# EAGLE design 8x8matrix_tlc4 (EAGLE 7.1.0)
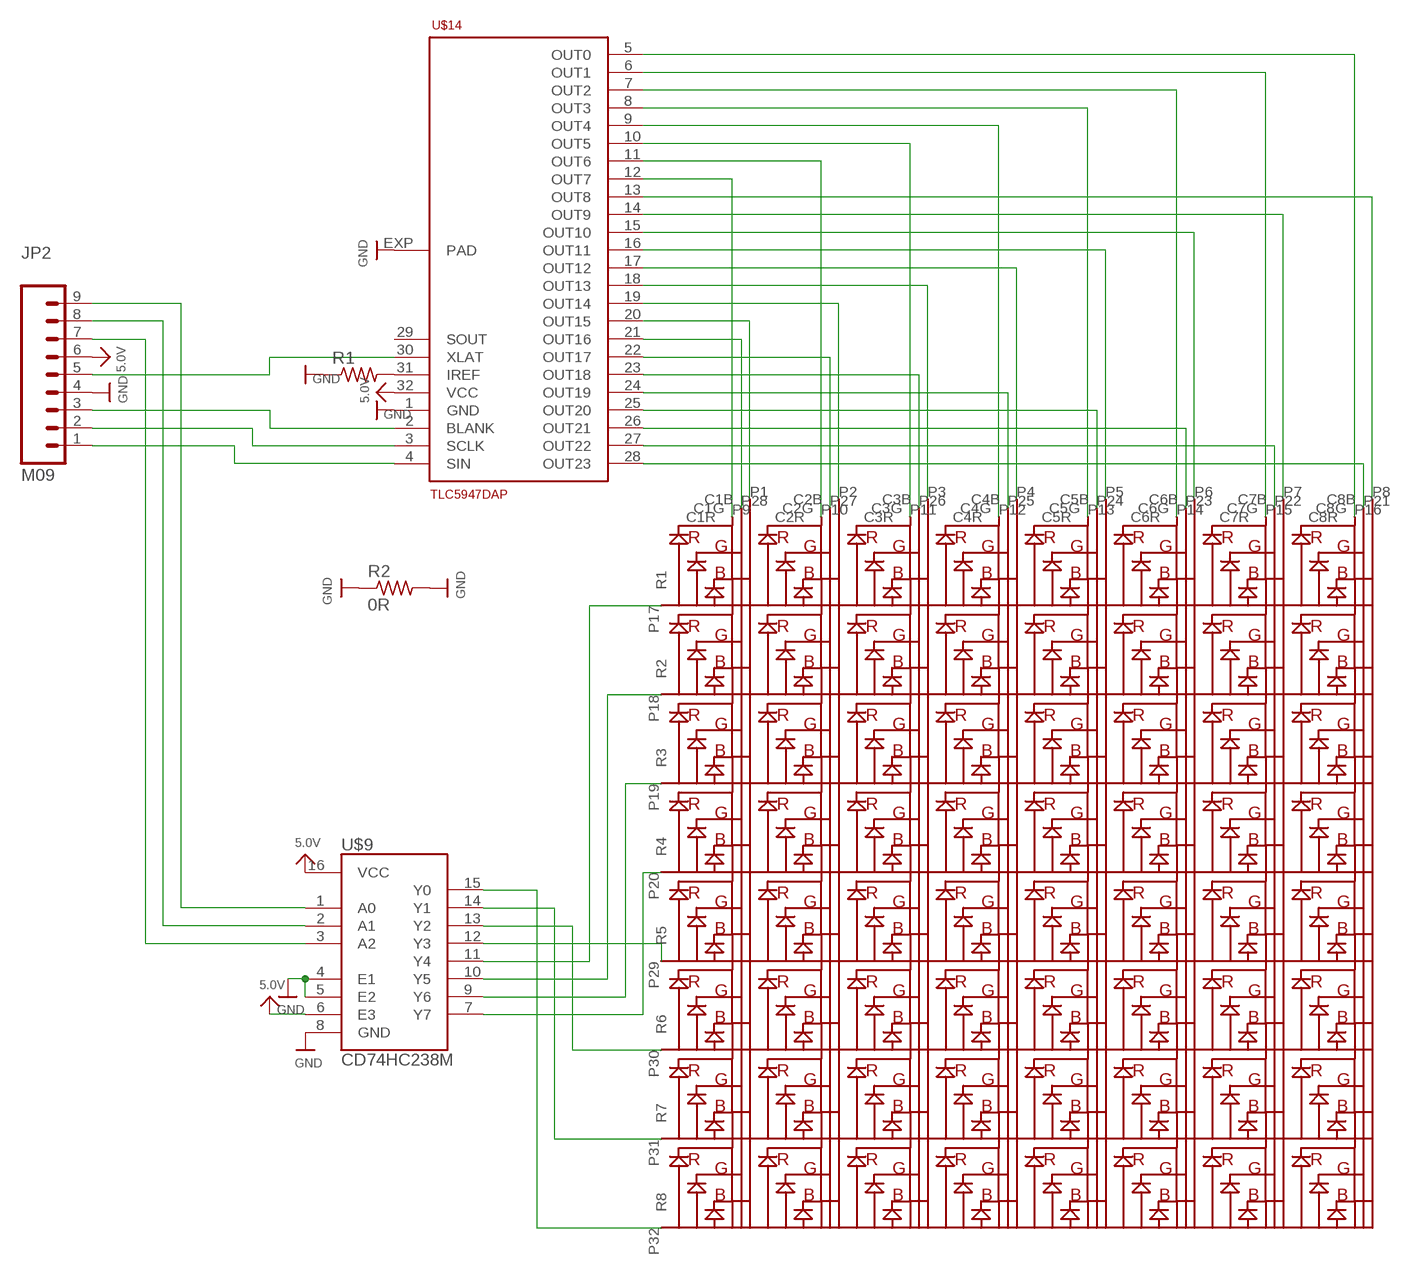
[diagram p0: schematic, sheet 1]

## Parts
JP2  M09  [1X09]
R1  R-US_R0805  [R0805]
R2  0R  R-US_M1206  [M1206]
U$1  GTM2088ARGB  [8X8MATRIX]
U$9  CD74HC238M  [SO-16]
U$14  TLC5947DAP  [HTSSOP32DAP]

## Nets
5.0V: JP2.6 U$9.6(E3) U$9.16(VCC) U$14.32(VCC)
BLANK: JP2.3 U$14.2(BLANK)
GND: JP2.4 R1.1 R2.1 R2.2 U$9.4(E1) U$9.5(E2) U$9.8(GND) U$14.1(GND) U$14.EXP(PAD)
N$1: U$1.P16(C8R) U$14.5(OUT0)
N$2: U$1.P15(C7R) U$14.6(OUT1)
N$3: U$1.P14(C6R) U$14.7(OUT2)
N$4: U$1.P13(C5R) U$14.8(OUT3)
N$5: U$1.P12(C4R) U$14.9(OUT4)
N$6: U$1.P11(C3R) U$14.10(OUT5)
N$7: U$1.P10(C2R) U$14.11(OUT6)
N$8: U$1.P9(C1R) U$14.12(OUT7)
N$9: U$1.P8(C8B) U$14.13(OUT8)
N$10: U$1.P7(C7B) U$14.14(OUT9)
N$11: U$1.P6(C6B) U$14.15(OUT10)
N$12: U$1.P5(C5B) U$14.16(OUT11)
N$13: U$1.P4(C4B) U$14.17(OUT12)
N$14: U$1.P3(C3B) U$14.18(OUT13)
N$15: U$1.P2(C2B) U$14.19(OUT14)
N$16: U$1.P1(C1B) U$14.20(OUT15)
N$17: U$1.P28(C1G) U$14.21(OUT16)
N$18: U$1.P27(C2G) U$14.22(OUT17)
N$19: U$1.P26(C3G) U$14.23(OUT18)
N$20: U$1.P25(C4G) U$14.24(OUT19)
N$21: U$1.P24(C5G) U$14.25(OUT20)
N$22: U$1.P23(C6G) U$14.26(OUT21)
N$23: U$1.P22(C7G) U$14.27(OUT22)
N$24: U$1.P21(C8G) U$14.28(OUT23)
N$25: JP2.5 U$14.30(XLAT)
N$26: U$1.P20(R4) U$9.7(Y7)
N$27: R1.2 U$14.31(IREF)
N$28: JP2.2 U$14.3(SCLK)
N$29: U$1.P19(R3) U$9.9(Y6)
N$30: U$1.P18(R2) U$9.10(Y5)
N$31: U$1.P17(R1) U$9.11(Y4)
N$32: U$1.P29(R5) U$9.12(Y3)
N$33: U$1.P30(R6) U$9.13(Y2)
N$34: U$1.P31(R7) U$9.14(Y1)
N$35: U$1.P32(R8) U$9.15(Y0)
N$36: JP2.9 U$9.1(A0)
N$37: JP2.8 U$9.2(A1)
N$38: JP2.7 U$9.3(A2)
SIN: JP2.1 U$14.4(SIN)
Unconnected: U$14.29(SOUT)

## Library data of the parts
JP2 = SparkFun-Connectors:M09: Header 9 Standard 9-pin 0.1" header. Use with straight break away headers (SKU : PRT-00116), right angle break away headers (PRT-00553), swiss pins (PRT-00743), machine pins (PRT-00117), and female headers (PRT-00115).
R1 R2 = resistor:R-US_: RESISTOR, American symbol
U$1 = mylib:GTM2088ARGB: a 8x8 RGB matrix
U$9 = mylib:CD74HC238: M74HC238 - CMOS 3 TO 8 LINE DECODER
U$14 = TLC5947:TLC5947

## Board
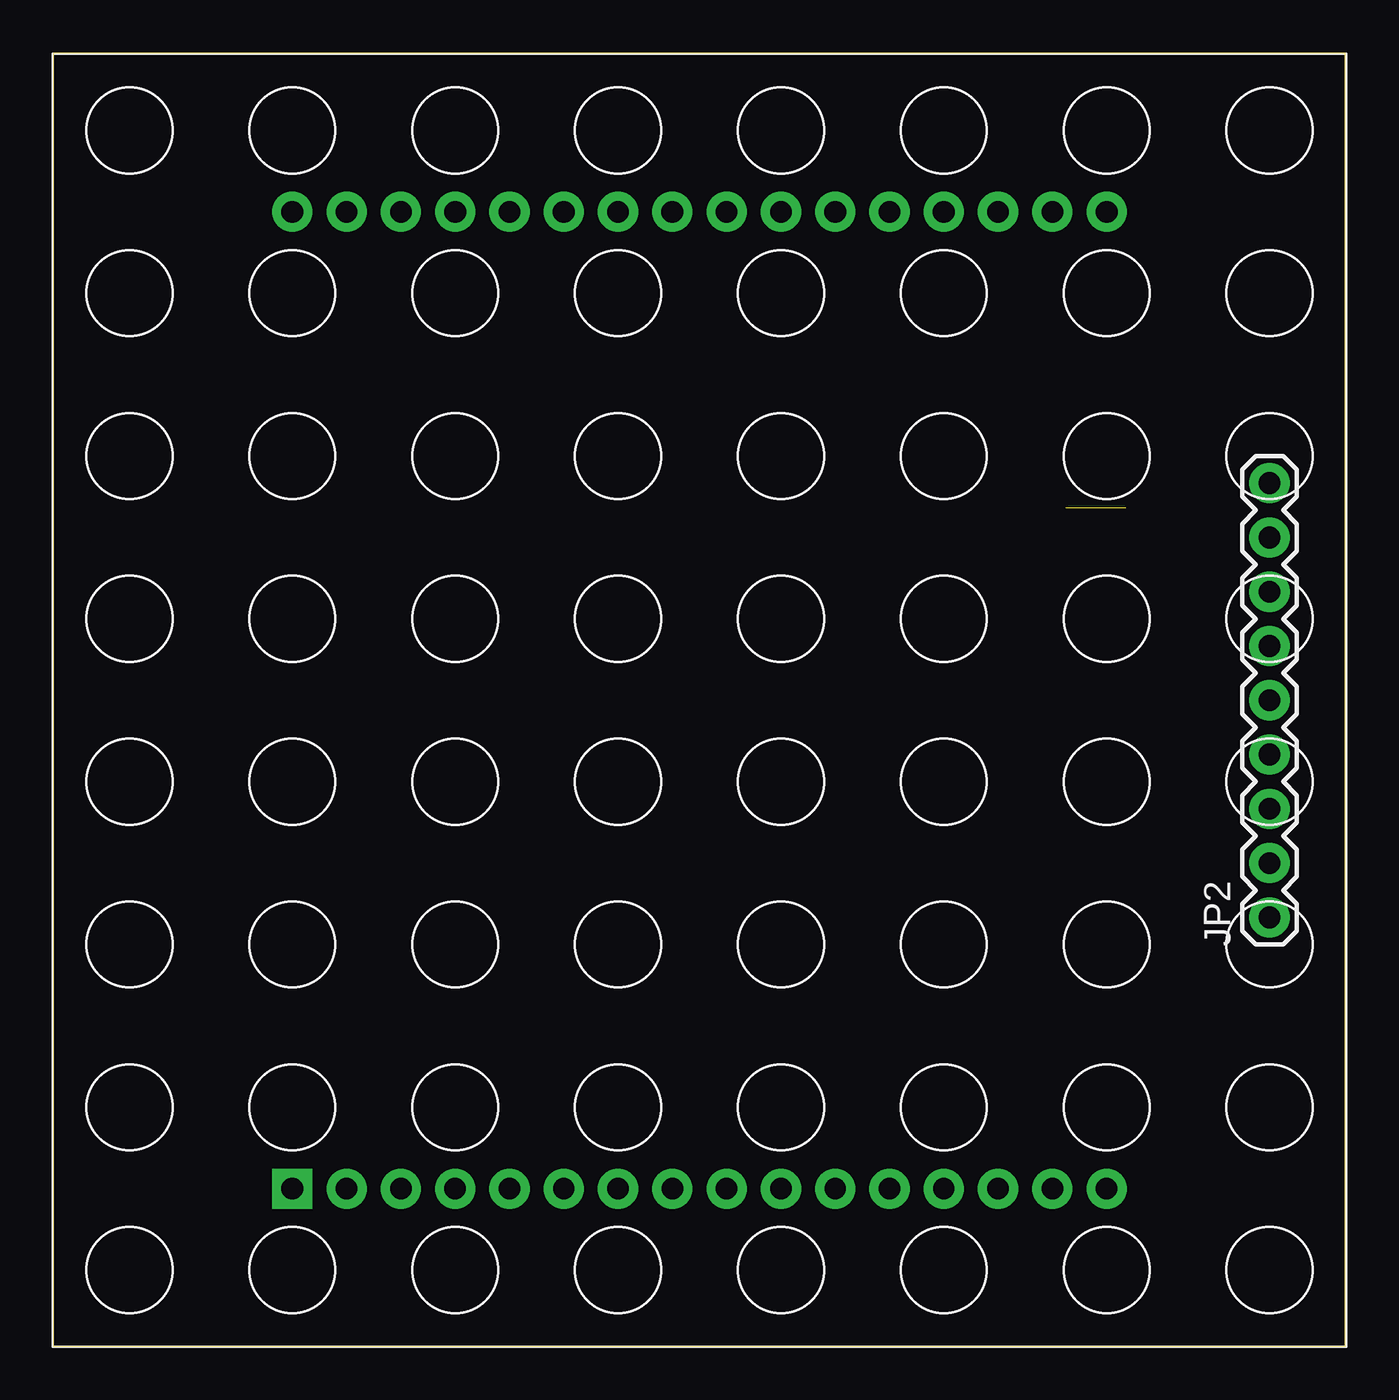
[diagram p1: board, top side]
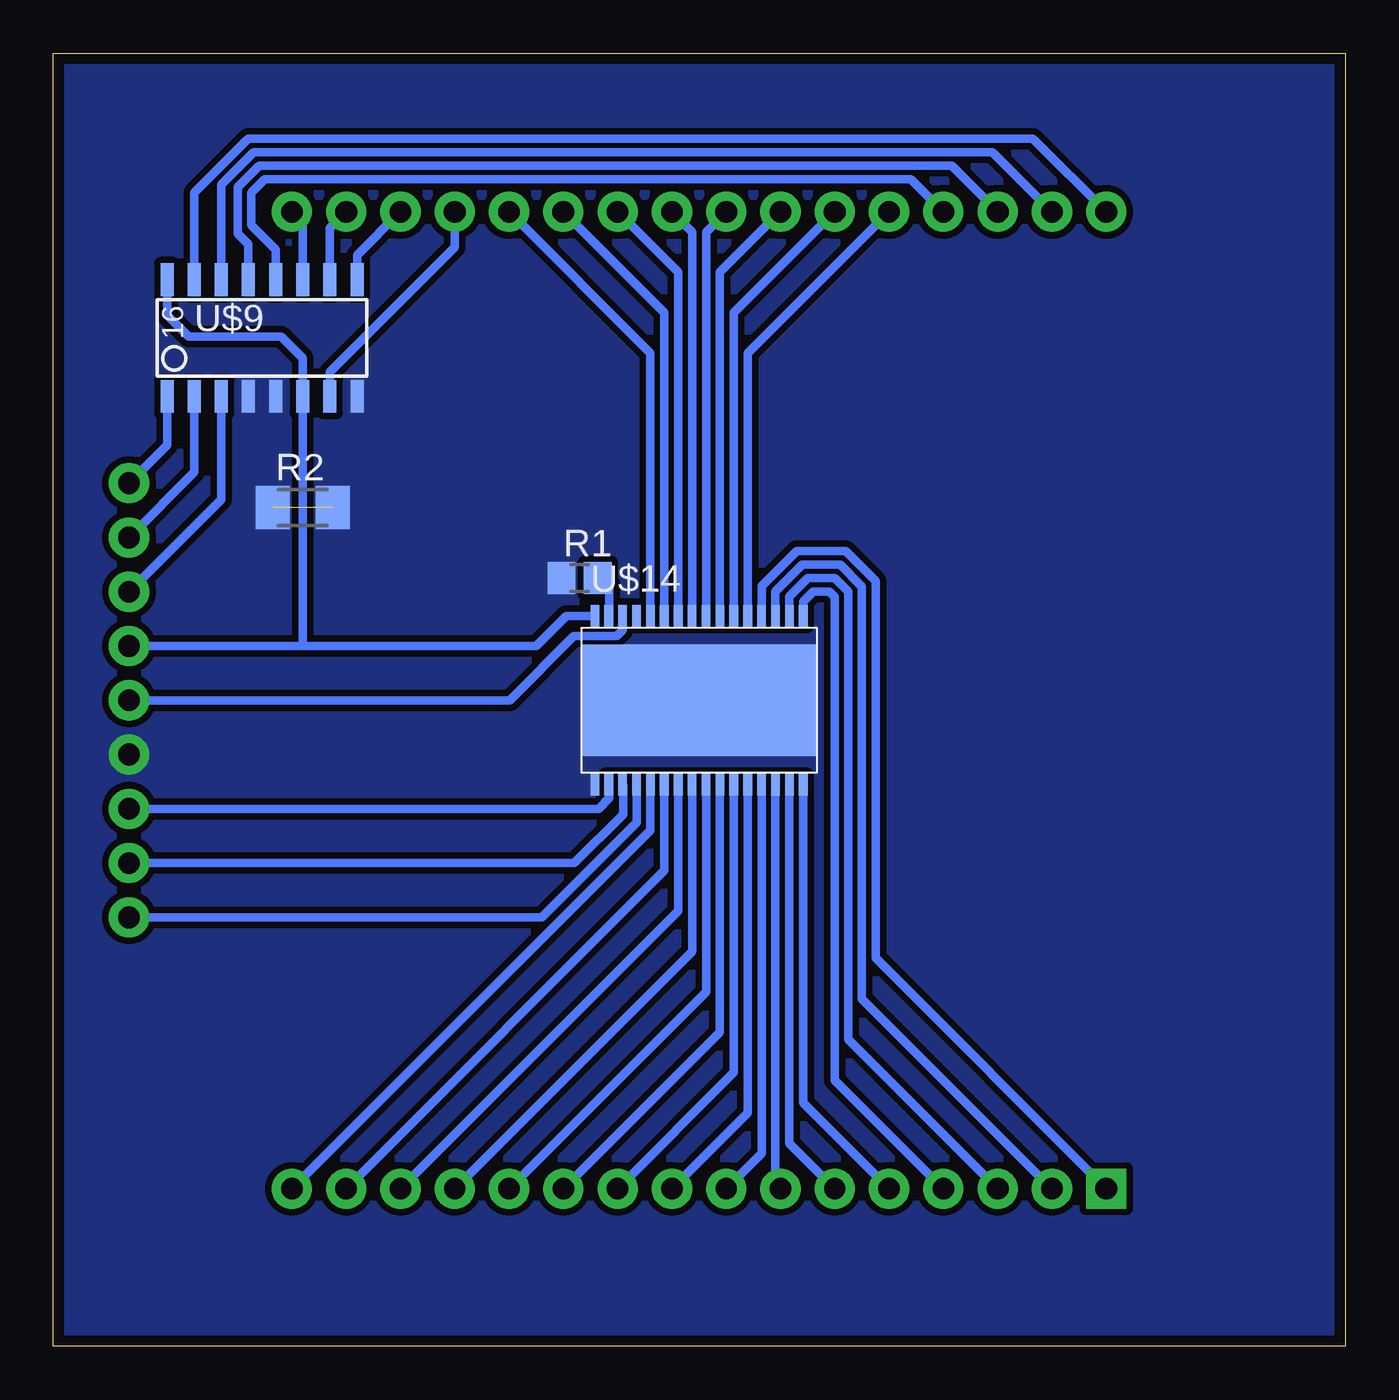
[diagram p2: board, bottom side, seen from below]

Size 60.43 x 60.5 mm. Coordinates in mm from the lower left corner, seen from the top.
Outline: 0,0 60.43,0 60.43,60.5 0,60.5 0,0
Copper layers (1*16): Top 0.035mm / dielectric 1.5mm / Bottom 0.035mm
Design rules "default *": minimum track width 10mil, minimum drill 24mil, track to track 8mil, track to pad 8mil, pad to pad 8mil, via to via 8mil, smd to smd 8mil, copper to edge 20mil, drill to drill 8mil, minimum pad ring 10mil, minimum via ring 8mil, stop-mask expansion 7mil, vias tented up to drill 0mil, thermal gap 10mil

### Footprints (pad centres in the part's own frame; a part is rotated, then mirrored left to right if it is on the bottom)
1X09 = drill 1.016 pad 1.88: 1 0,0; 2 2.54,0; 3 5.08,0; 4 7.62,0; 5 10.16,0; 6 12.7,0; 7 15.24,0; 8 17.78,0; 9 20.32,0
R0805 = smd 1.3 x 1.5: 1 -0.85,0; 2 0.85,0
M1206 = smd 1.6 x 2: 1 -1.4,0; 2 1.4,0
8X8MATRIX = drill 1.016 pad 1.88 square: P1 -19.05,-22.86 | drill 1.016 pad 1.88: P2 -16.51,-22.86; P3 -13.97,-22.86; P17 19.05,22.86; P18 16.51,22.86; P19 13.97,22.86; P20 11.43,22.86; P21 8.89,22.86; P22 6.35,22.86; P23 3.81,22.86; P24 1.27,22.86; P25 -1.27,22.86; P26 -3.81,22.86; P27 -6.35,22.86; P28 -8.89,22.86; P29 -11.43,22.86; P30 -13.97,22.86; P31 -16.51,22.86; P32 -19.05,22.86 | drill 1 pad 1.88: P4 -11.43,-22.86; P5 -8.89,-22.86; P6 -6.35,-22.86; P7 -3.81,-22.86; P8 -1.27,-22.86; P9 1.27,-22.86; P10 3.81,-22.86; P11 6.35,-22.86; P12 8.89,-22.86; P13 11.43,-22.86; P14 13.97,-22.86; P15 16.51,-22.86; P16 19.05,-22.86
SO-16 = smd 0.61 x 1.524: 1 -4.445,-2.794; 2 -3.175,-2.794; 3 -1.905,-2.794; 4 -0.635,-2.794; 5 0.635,-2.794; 6 1.905,-2.794; 7 3.175,-2.794; 8 4.445,-2.794; 9 4.445,2.667; 10 3.175,2.667; 11 1.905,2.667; 12 0.635,2.667; 13 -0.635,2.667; 14 -1.905,2.667; 15 -3.175,2.667; 16 -4.445,2.667
HTSSOP32DAP = smd 0.406 x 1: 1 -4.875,-3.95; 2 -4.225,-3.95; 3 -3.575,-3.95; 4 -2.925,-3.95; 5 -2.275,-3.95; 6 -1.625,-3.95; 7 -0.975,-3.95; 8 -0.325,-3.95; 9 0.325,-3.95; 10 0.975,-3.95; 11 1.625,-3.95; 12 2.275,-3.95; 13 2.925,-3.95; 14 3.575,-3.95; 15 4.225,-3.95; 16 4.875,-3.95; 17 4.875,3.95; 18 4.225,3.95; 19 3.575,3.95; 20 2.925,3.95; 21 2.275,3.95; 22 1.625,3.95; 23 0.975,3.95; 24 0.325,3.95; 25 -0.325,3.95; 26 -0.975,3.95; 27 -1.625,3.95; 28 -2.275,3.95; 29 -2.925,3.95; 30 -3.575,3.95; 31 -4.225,3.95; 32 -4.875,3.95 | smd 11 x 5.2: EXP 0,0

### Placement (x,y rotation side)
JP2  56.9,20.07 90 top
R1  35.81,35.94 0 bottom
R2  48.77,39.24 0 bottom
U$1  30.23,30.23 0 top
U$9  50.67,47.24 0 bottom
U$14  30.23,30.23 0 bottom

### Tracks (layer width: path | path; a pad name or v marks a point on that pad's centre or on a via)
5.0V
  Bottom 0.406: JP2.6 48.77,32.77 | U$14.32 35.11,34.16 36.45,34.16 37.85,32.77 46.99,32.77 48.77,32.77 | U$9.16 55.12,48.26 54.1,47.24 49.78,47.24 48.77,46.23 U$9.6 48.77,32.77
BLANK
  Bottom 0.406: JP2.3 34.92,25.15 34.42,25.65 34.42,26.24 U$14.2
GND  (1 unrouted)
  pour Bottom (isolate 0.305, no thermals): 0,60.5 0,0 60.45,0 60.45,60.5
N$1
  Bottom 0.406: U$14.5 32.5,24.14 U$1.P16
N$2
  Bottom 0.406: U$14.6 31.85,22.25 U$1.P15
N$3
  Bottom 0.406: U$14.7 31.2,20.36 U$1.P14
N$4
  Bottom 0.406: U$14.8 30.55,18.47 U$1.P13
N$5
  Bottom 0.406: U$14.9 29.9,16.58 U$1.P12
N$6
  Bottom 0.406: U$14.10 29.25,14.69 U$1.P11
N$7
  Bottom 0.406: U$14.11 28.6,12.8 U$1.P10
N$8
  Bottom 0.406: U$14.12 27.95,10.91 U$1.P9
N$9
  Bottom 0.406: U$14.13 27.3,9.02 U$1.P8
N$10
  Bottom 0.406: U$14.14 26.65,7.6 U$1.P7
N$11
  Bottom 0.406: U$14.15 26,9.49 U$1.P6
N$12
  Bottom 0.406: U$14.16 25.35,11.38 U$1.P5
N$13
  Bottom 0.406: U$14.17 25.35,34.85 24.89,35.31 24.13,35.31 23.88,35.05 23.88,12.45 U$1.P4
N$14
  Bottom 0.406: U$14.18 26,35.09 25.15,35.94 23.88,35.94 23.24,35.31 23.24,14.35 U$1.P3
N$15
  Bottom 0.406: U$14.19 26.65,35.33 25.4,36.58 23.62,36.58 22.61,35.56 22.61,16.26 U$1.P2
N$16
  Bottom 0.406: U$14.20 27.3,35.56 25.65,37.21 23.37,37.21 21.97,35.81 21.97,18.16 U$1.P1
N$17
  Bottom 0.406: U$14.21 27.95,46.47 U$1.P28
N$18
  Bottom 0.406: U$14.22 28.6,48.36 U$1.P27
N$19
  Bottom 0.406: U$14.23 29.25,50.25 U$1.P26
N$20
  Bottom 0.406: U$14.24 29.9,52.14 U$1.P25
N$21
  Bottom 0.406: U$14.25 30.55,52.14 U$1.P24
N$22
  Bottom 0.406: U$14.26 31.2,50.25 U$1.P23
N$23
  Bottom 0.406: U$14.27 31.85,48.36 U$1.P22
N$24
  Bottom 0.406: U$14.28 32.5,46.47 U$1.P21
N$25
  Bottom 0.406: U$14.30 33.8,33.51 34.07,33.24 36.08,33.24 39.09,30.23 JP2.5
N$26
  Bottom 0.406: U$9.7 47.5,45.59 41.66,51.44 U$1.P20
N$27
  Bottom 0.406: U$14.31 34.42,34.21 34.42,35.69 34.67,35.94 R1.2
N$28
  Bottom 0.406: JP2.2 36.07,22.61 33.78,24.89 33.78,26.26 U$14.3
N$29
  Bottom 0.406: U$9.9 46.23,51.05 U$1.P19
N$30
  Bottom 0.406: U$9.10 47.5,52.32 U$1.P18
N$31
  Bottom 0.406: U$9.11 48.77,52.58 U$1.P17
N$32
  Bottom 0.406: U$9.12 50.04,51.31 51.18,52.45 51.18,53.98 50.55,54.61 20.32,54.61 U$1.P29
N$33
  Bottom 0.406: U$9.13 51.31,51.56 51.82,52.07 51.82,54.23 50.8,55.24 18.41,55.24 U$1.P30
N$34
  Bottom 0.406: U$1.P31 16.51,55.88 51.05,55.88 52.58,54.36 U$9.14
N$35
  Bottom 0.406: U$9.15 53.85,53.98 51.31,56.52 14.61,56.52 U$1.P32
N$36
  Bottom 0.406: U$9.1 55.12,42.16 JP2.9
N$37
  Bottom 0.406: U$9.2 53.85,40.89 JP2.8
N$38
  Bottom 0.406: U$9.3 52.58,39.62 JP2.7
SIN
  Bottom 0.406: JP2.1 37.59,20.07 33.15,24.51 U$14.4